# EAGLE schematic bigPCBsch (EAGLE 8.6.0)
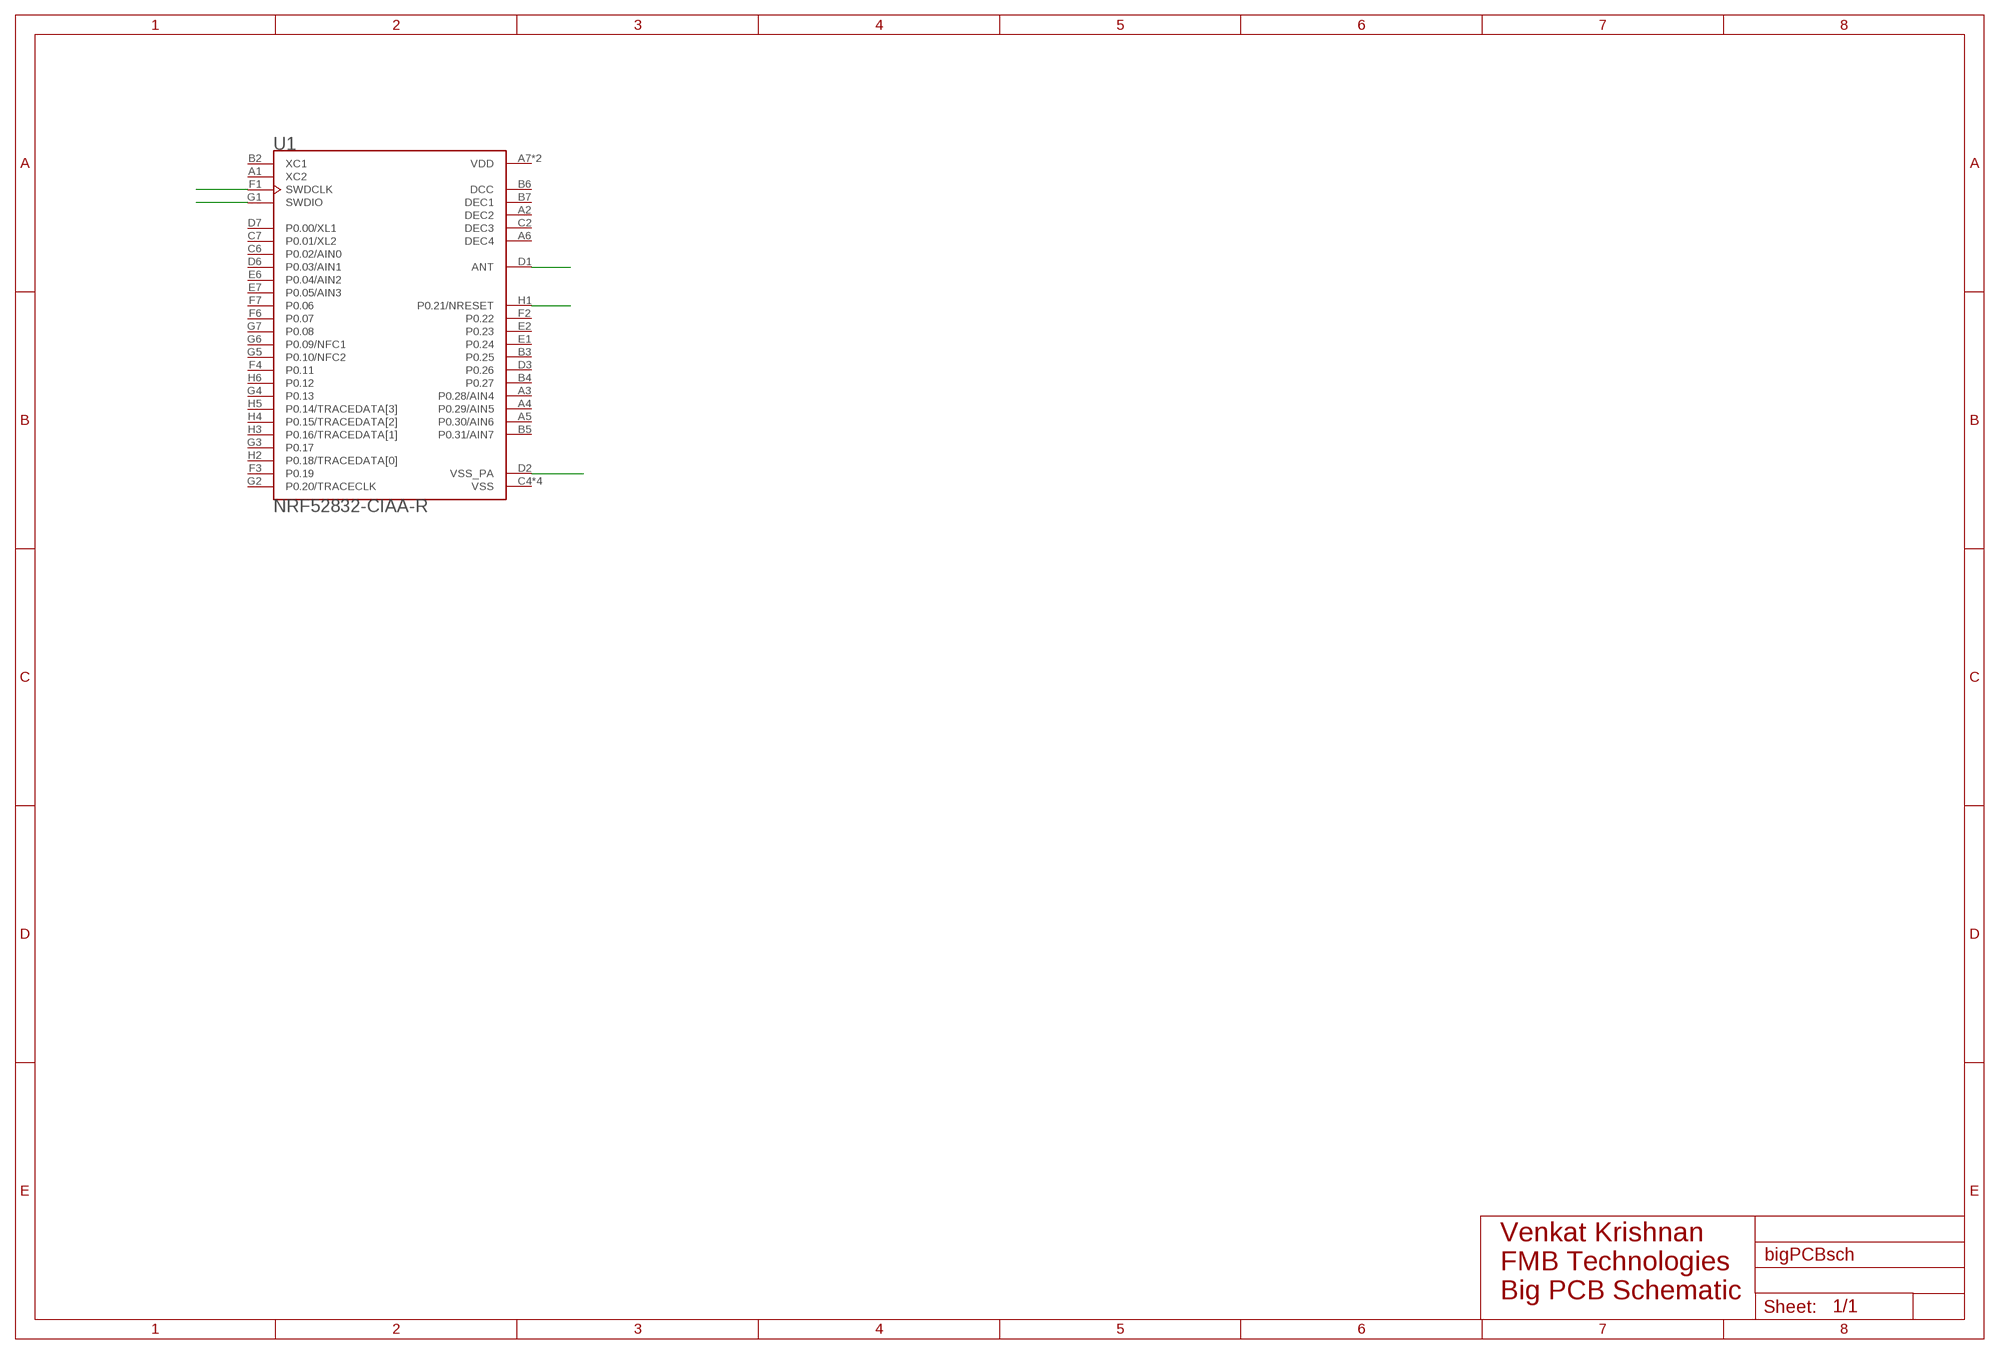
[diagram p0: schematic, sheet 1]

## Parts
U1  NRF52832-CIAA-R  [NRFWLCSP]

## Nets
N$1: U1.F1(SWDCLK)
N$2: U1.G1(SWDIO)
N$3: U1.H1(P0.21/NRESET)
N$4: U1.D1(ANT)
N$5: U1.D2(VSS_PA)
Unconnected: U1.A1(XC2) U1.A3(P0.28/AIN4) U1.A4(P0.29/AIN5) U1.A5(P0.30/AIN6) U1.B2(XC1) U1.B3(P0.25) U1.B4(P0.27) U1.B5(P0.31/AIN7) U1.C6(P0.02/AIN0) U1.C7(P0.01/XL2) U1.D3(P0.26) U1.D6(P0.03/AIN1) U1.D7(P0.00/XL1) U1.E1(P0.24) U1.E2(P0.23) U1.E6(P0.04/AIN2) U1.E7(P0.05/AIN3) U1.F2(P0.22) U1.F3(P0.19) U1.F4(P0.11) U1.F6(P0.07) U1.F7(P0.06) U1.G2(P0.20/TRACECLK) U1.G3(P0.17) U1.G4(P0.13) U1.G5(P0.10/NFC2) U1.G6(P0.09/NFC1) U1.G7(P0.08) U1.H2(P0.18/TRACEDATA[0]) U1.H3(P0.16/TRACEDATA[1]) U1.H4(P0.15/TRACEDATA[2]) U1.H5(P0.14/TRACEDATA[3]) U1.H6(P0.12)

## Notes on the sheet
- Venkat Krishnan
  FMB Technologies
  Big PCB Schematic

## Power pins joined to a net without a drawn wire
DCC: U1.B6(DCC)
DEC1: U1.B7(DEC1)
DEC2: U1.A2(DEC2)
DEC3: U1.C2(DEC3)
DEC4: U1.A6(DEC4)
VDD: U1.A7(VDD) U1.H7(VDD)
VSS: U1.C4(VSS) U1.C5(VSS) U1.E3(VSS) U1.F5(VSS)

## Library data of the parts
U1 = NRF52832-CIAA-R:NRF52832-CIAA-R: Multi Protocal Bluetooth Smart ANT 2.4GHz RF SoC (WL-CSP); AVAILABILITY: Good; DESCRIPTION: IC RF TXRX+MCU BLUETOOTH 50WLCSP; MF: Nordic; MP: NRF52832-CIAA-R; PACKAGE: XFBGA-50 Nordic Semiconductor; PRICE: 3.87 USD